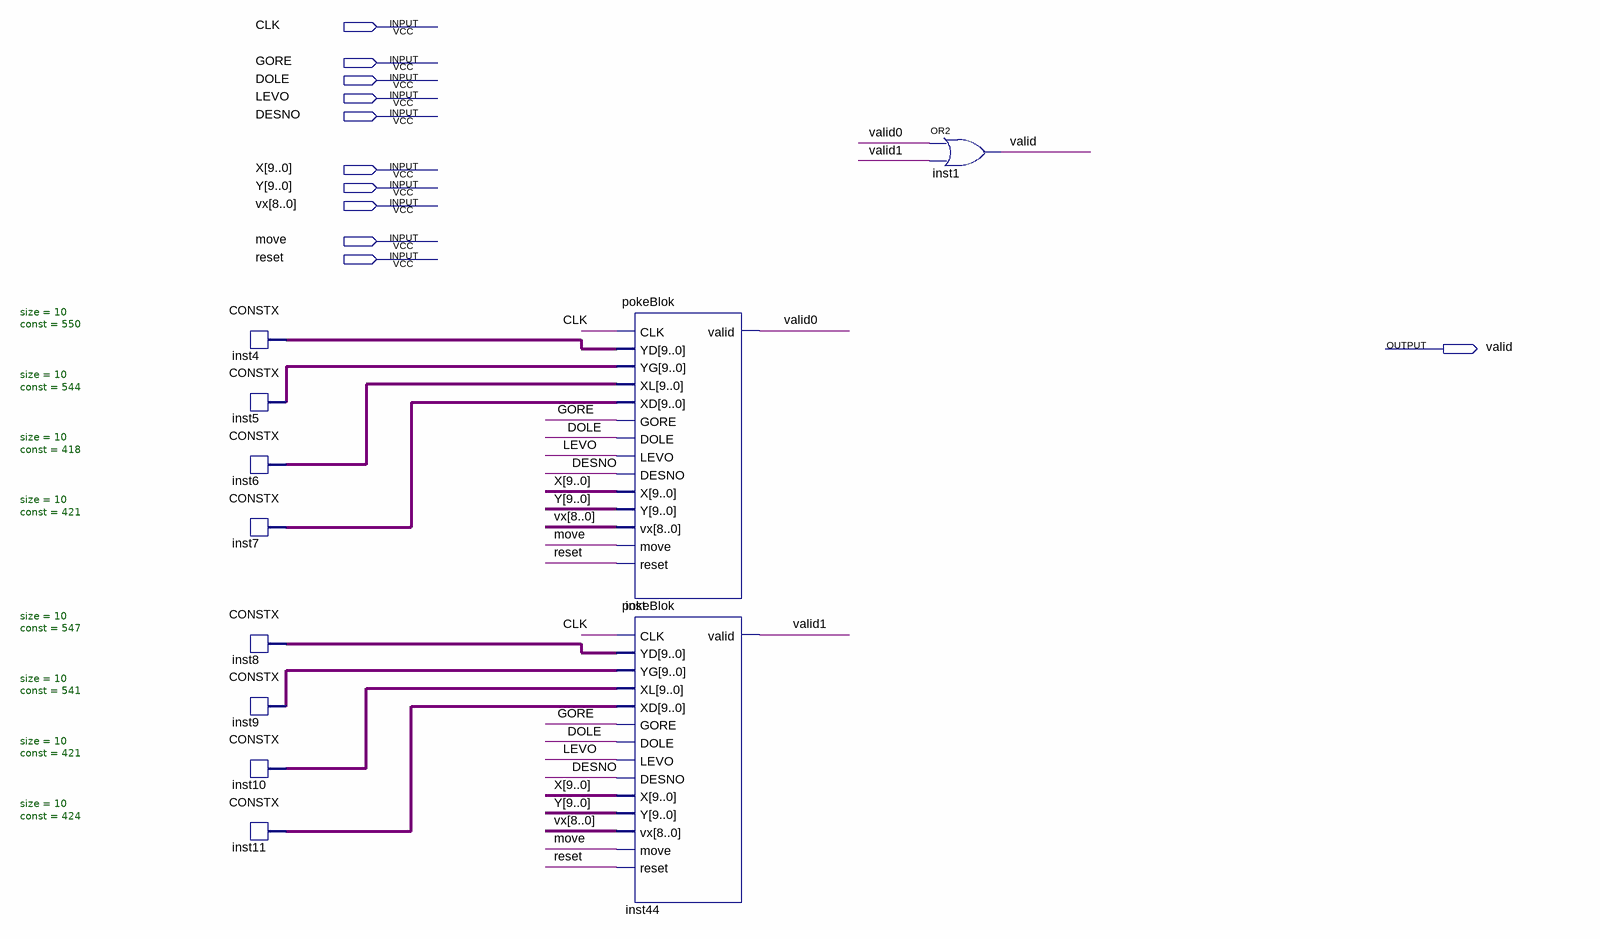
[diagram p0: schematic sheet]
// Quartus schematic zutiPokeRep.bdf as structural Verilog: 11 symbols, 11 pins
module zutiPokeRep (
  input  CLK,
  input  GORE,
  input  DOLE,
  input  LEVO,
  input  DESNO,
  input  [9:0] X,
  input  [9:0] Y,
  input  [8:0] vx,
  input  move,
  input  reset,
  output valid
);

  wire valid0, valid1;
  wire [9:0] inst4_data, inst5_data, inst6_data, inst7_data, inst8_data, inst9_data, inst10_data, inst11_data;

  CONSTX #(.size(10), .\const (550)) inst4 (.data(inst4_data));
  CONSTX #(.size(10), .\const (544)) inst5 (.data(inst5_data));
  CONSTX #(.size(10), .\const (418)) inst6 (.data(inst6_data));
  CONSTX #(.size(10), .\const (421)) inst7 (.data(inst7_data));
  CONSTX #(.size(10), .\const (547)) inst8 (.data(inst8_data));
  CONSTX #(.size(10), .\const (541)) inst9 (.data(inst9_data));
  CONSTX #(.size(10), .\const (421)) inst10 (.data(inst10_data));
  CONSTX #(.size(10), .\const (424)) inst11 (.data(inst11_data));
  pokeBlok inst (
    .CLK(CLK), .YD(inst4_data), .YG(inst5_data), .XL(inst6_data), .XD(inst7_data), .GORE(GORE), .DOLE(DOLE),
    .LEVO(LEVO), .DESNO(DESNO), .X(X), .Y(Y), .vx(vx), .move(move), .reset(reset), .valid(valid0));
  pokeBlok inst44 (
    .CLK(CLK), .YD(inst8_data), .YG(inst9_data), .XL(inst10_data), .XD(inst11_data), .GORE(GORE),
    .DOLE(DOLE), .LEVO(LEVO), .DESNO(DESNO), .X(X), .Y(Y), .vx(vx), .move(move), .reset(reset), .valid(valid1));
  or inst1 (valid, valid0, valid1);
endmodule
